# Altium schematic sheet soc-conn.SchDoc: SOC-CONN
size A4; Date: 09.29.2026; CheckedBy: BCY; DrawnBy: miaow; Revision: v1.0.0; SheetNumber: 6; SheetTotal: 18; BoardType: MAIN_PCB; Desc: Conectivity, USB, HDMI, ETH
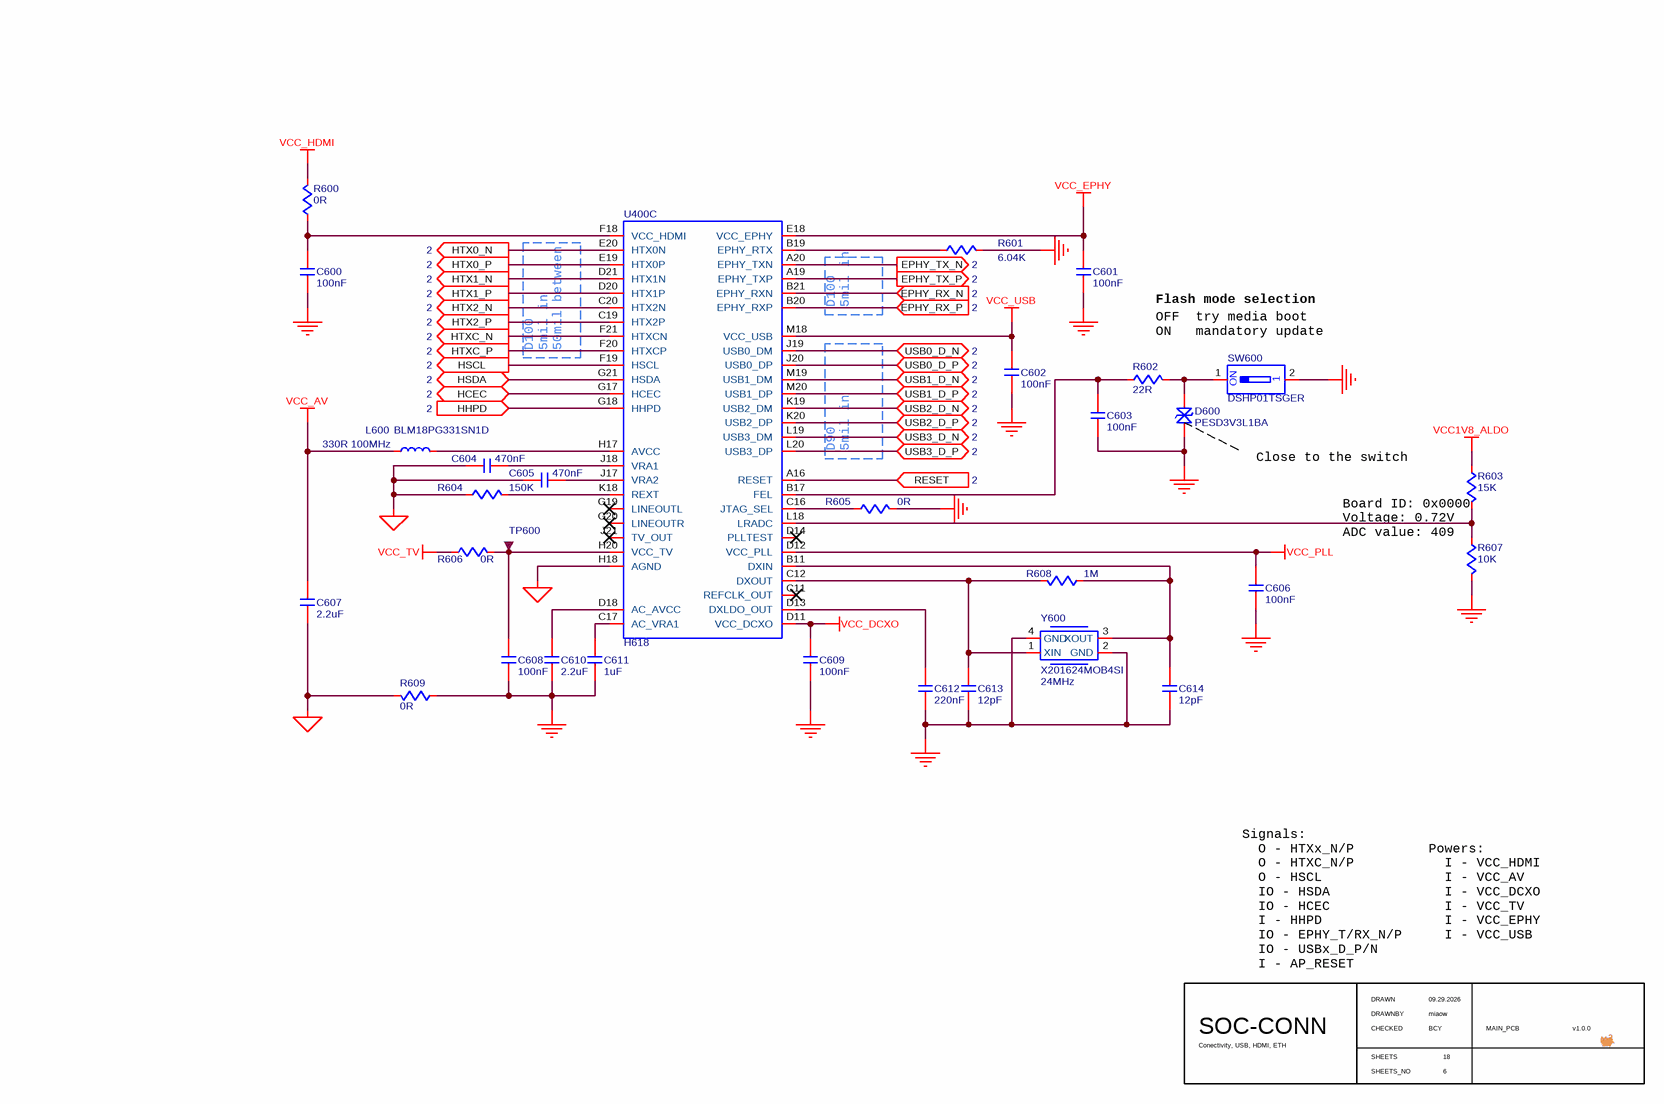
[diagram p0: soc-conn.SchDoc]

## Parts
C600  value 100nF  [C0201]  (hidden comment: C-NOMO)
C601  value 100nF  [C0201]  (hidden comment: C-NOMO)
C602  value 100nF  [C0201]  (hidden comment: C-NOMO)
C603  value 100nF  [C0402]  (hidden comment: C-NOMO)
C604  value 470nF  [C0201]  (hidden comment: C-NOMO)
C605  value 470nF  [C0201]  (hidden comment: C-NOMO)
C606  value 100nF  [C0201]  (hidden comment: C-NOMO)
C607  value 2.2uF  [C0402]  (hidden comment: C-NOMO)
C608  value 100nF  [C0201]  (hidden comment: C-NOMO)
C609  value 100nF  [C0201]  (hidden comment: C-NOMO)
C610  value 2.2uF  [C0402]  (hidden comment: C-NOMO)
C611  value 1uF  [C0201]  (hidden comment: C-NOMO)
C612  value 220nF  [C0201]  (hidden comment: C-NOMO)
C613  value 12pF  [C0402]  (hidden comment: C-NOMO)
C614  value 12pF  [C0402]  (hidden comment: C-NOMO)
D600  PESD3V3L1BA  [PESD3V3L1BA]
L600  BLM18PG331SN1D  value 330R 100MHz  [L0603]
R600  value 0R  [R0402]  (hidden comment: R)
R601  value 6.04K  [R0402]  (hidden comment: R)
R602  value 22R  [R0402]  (hidden comment: R)
R603  value 15K  [R0402]  (hidden comment: R)
R604  value 150K  [R0402]  (hidden comment: R)
R605  value 0R  [R0402]  (hidden comment: R)
R606  value 0R  [R0402]  (hidden comment: R)
R607  value 10K  [R0402]  (hidden comment: R)
R608  value 1M  [R0402]  (hidden comment: R)
R609  value 0R  [R0402]  (hidden comment: R)
SW600  DSHP01TSGER  [DSHP01TSGER]
TP600  TP  [TP]  (value not drawn)
U400  H618  [H618]  (part C of 4)
Y600  X201624MOB4SI  value 24MHz  [X201624MOB4SI]

## Ports
EPHY_RX_N (in, see 2), EPHY_RX_P (in, see 2), EPHY_TX_N (out, see 2), EPHY_TX_P (out, see 2), HCEC (bidir, see 2), HHPD (in, see 2), HSCL (out, see 2), HSDA (bidir, see 2), HTX0_N (out, see 2), HTX0_P (out, see 2), HTX1_N (out, see 2), HTX1_P (out, see 2), HTX2_N (out, see 2), HTX2_P (out, see 2), HTXC_N (out, see 2), HTXC_P (out, see 2), RESET (in, see 2), USB0_D_N (bidir, see 2), USB0_D_P (bidir, see 2), USB1_D_N (bidir, see 2), USB1_D_P (bidir, see 2), USB2_D_N (bidir, see 2), USB2_D_P (bidir, see 2), USB3_D_N (bidir, see 2), USB3_D_P (bidir, see 2)

## Nets
AGND: C604.2 C605.2 C607.1 R604.2 R609.1 U400.H18(AGND)
GND: C600.2 C601.2 C602.2 C603.2 C606.2 C608.2 C609.2 C610.1 C611.1 C612.2 C613.2 C614.2 D600.1 R601.1 R605.1 R607.1 R609.2 SW600.2 Y600.2(GND) Y600.4(GND)
VCC1V8_ALDO: R603.2
VCC_AV: C607.2 L600.1
VCC_DCXO: C609.1 U400.D11(VCC_DCXO)
VCC_EPHY: C601.1 U400.E18(VCC_EPHY)
VCC_HDMI: R600.1
VCC_PLL: C606.1 U400.D12(VCC_PLL)
VCC_TV: R606.2
VCC_USB: C602.1 U400.M18(VCC_USB)
EPHY_RX_N: U400.B21(EPHY_RXN) ; port EPHY_RX_N
EPHY_RX_P: U400.B20(EPHY_RXP) ; port EPHY_RX_P
EPHY_TX_N: U400.A20(EPHY_TXN) ; port EPHY_TX_N
EPHY_TX_P: U400.A19(EPHY_TXP) ; port EPHY_TX_P
HCEC: U400.G17(HCEC) ; port HCEC
HHPD: U400.G18(HHPD) ; port HHPD
HSCL: U400.F19(HSCL) ; port HSCL
HSDA: U400.G21(HSDA) ; port HSDA
HTX0_N: U400.E20(HTX0N) ; port HTX0_N
HTX0_P: U400.E19(HTX0P) ; port HTX0_P
HTX1_N: U400.D21(HTX1N) ; port HTX1_N
HTX1_P: U400.D20(HTX1P) ; port HTX1_P
HTX2_N: U400.C20(HTX2N) ; port HTX2_N
HTX2_P: U400.C19(HTX2P) ; port HTX2_P
HTXC_N: U400.F21(HTXCN) ; port HTXC_N
HTXC_P: U400.F20(HTXCP) ; port HTXC_P
RESET: U400.A16(RESET) ; port RESET
USB0_D_N: U400.J19(USB0_DM) ; port USB0_D_N
USB0_D_P: U400.J20(USB0_DP) ; port USB0_D_P
USB1_D_N: U400.M19(USB1_DM) ; port USB1_D_N
USB1_D_P: U400.M20(USB1_DP) ; port USB1_D_P
USB2_D_N: U400.K19(USB2_DM) ; port USB2_D_N
USB2_D_P: U400.K20(USB2_DP) ; port USB2_D_P
USB3_D_N: U400.L19(USB3_DM) ; port USB3_D_N
USB3_D_P: U400.L20(USB3_DP) ; port USB3_D_P
NetC600_1: C600.1 R600.2 U400.F18(VCC_HDMI)
NetC603_1: C603.1 R602.2 U400.B17(FEL)
NetC604_1: C604.1 U400.J18(VRA1)
NetC605_1: C605.1 U400.J17(VRA2)
NetC608_1: C608.1 R606.1 TP600.0 U400.H20(VCC_TV)
NetC610_2: C610.2 U400.D18(AC_AVCC)
NetC611_2: C611.2 U400.C17(AC_VRA1)
NetC612_1: C612.1 U400.D13(DXLDO_OUT)
NetC613_1: C613.1 R608.1 U400.C12(DXOUT) Y600.1(XIN)
NetC614_1: C614.1 R608.2 U400.B11(DXIN) Y600.3(XOUT)
NetD600_2: D600.2 R602.1 SW600.1
NetL600_2: L600.2 U400.H17(AVCC)
NetR601_2: R601.2 U400.B19(EPHY_RTX)
NetR603_1: R603.1 R607.2 U400.L18(LRADC)
NetR604_1: R604.1 U400.K18(REXT)
NetR605_2: R605.2 U400.C16(JTAG_SEL)

Not connected (* = marked no-connect by the designer): U400 C11(REFCLK_OUT)* D14(PLLTEST)* G19(LINEOUTL)* G20(LINEOUTR)* J21(TV_OUT)*

## Notes on the sheet
- (near U400) D100
- 5mil in
- Flash mode selection
- OFF  try media boot
  ON   mandatory update
- D100
- 50mil between
- D90
- Close to the switch
- (near R603) Board ID: 0x0000
  Voltage: 0.72V
  ADC value: 409
- Powers:
  I - VCC_HDMI
  I - VCC_AV
  I - VCC_DCXO
  I - VCC_TV
  I - VCC_EPHY
  I - VCC_USB
- Signals:
  O - HTXx_N/P
  O - HTXC_N/P
  O - HSCL
  IO - HSDA
  IO - HCEC
  I - HHPD
  IO - EPHY_T/RX_N/P
  IO - USBx_D_P/N
  I - AP_RESET
- DRAWN
- CHECKED
- DRAWNBY
- SHEETS
- SHEETS_NO
- (in symbol DSHP01TSGER) ON

## Library data of the parts
C600-C602 C606 C608 C609 = C-NOMO: voltage: 10V; precision: 10%; Supplier 1: LCSC; Supplier Part Number 1: C49062
C603 = C-NOMO: voltage: 50V; precision: 10%; Supplier 1: LCSC; Supplier Part Number 1: C307331
C604 C605 C607 C610-C612 = C-NOMO: voltage: 6.3V; precision: 20%; Supplier 1: LCSC
  C604 C605: Supplier Part Number 1: C159817
  C607 C610: Supplier Part Number 1: C12530
  C611: Supplier Part Number 1: C53067
  C612: Supplier Part Number 1: C34696
C613 C614 = C-NOMO: voltage: 50V; precision: 5%; Supplier 1: LCSC; Supplier Part Number 1: C1547
D600 = PESD3V3L1BA: TVS/ESD - 1 ch, 3.3V, 4V, 100pF@1MHz, 30KV; Supplier 1: LCSC; Supplier Part Number 1: C2687129
L600 = L: Code_IEC: 1005; Published: 8-Jun-2000; LatestRevisionDate: 29-May-2009; LatestRevisionNote: IPC-7351 Footprint Added.; PackageReference: 0402-A; Publisher: Altium Limited; PackageDescription: Chip Inductor; Code_JEITA: 0402; Supplier 1: LCSC; Supplier Part Number 1: C79913
R600-R609 = R: precision: 1%; Supplier 1: LCSC
  R600 R605 R606 R609: Supplier Part Number 1: C17168
  R601: Supplier Part Number 1: C25913
  R602: Supplier Part Number 1: C25092
  R603: Supplier Part Number 1: C25756
  R604: Supplier Part Number 1: C25755
  R607: Supplier Part Number 1: C25744
  R608: Supplier Part Number 1: C26083
SW600 = DSHP01TSGER: SWITCH - SPST, 1ch; Supplier 1: LCSC; Supplier Part Number 1: C3293141
U400 = H618: SOC; Supplier 1: LCSC; Supplier Part Number 1: C19189292
Y600 = X201624MOB4SI: XTAL - passive, 24MHz, ±10ppm, 12pF; Supplier 1: LCSC; Supplier Part Number 1: C5210655